# Altium schematic sheet uVNA.SchDoc
size A4; SheetNumber: 1; SheetTotal: 13
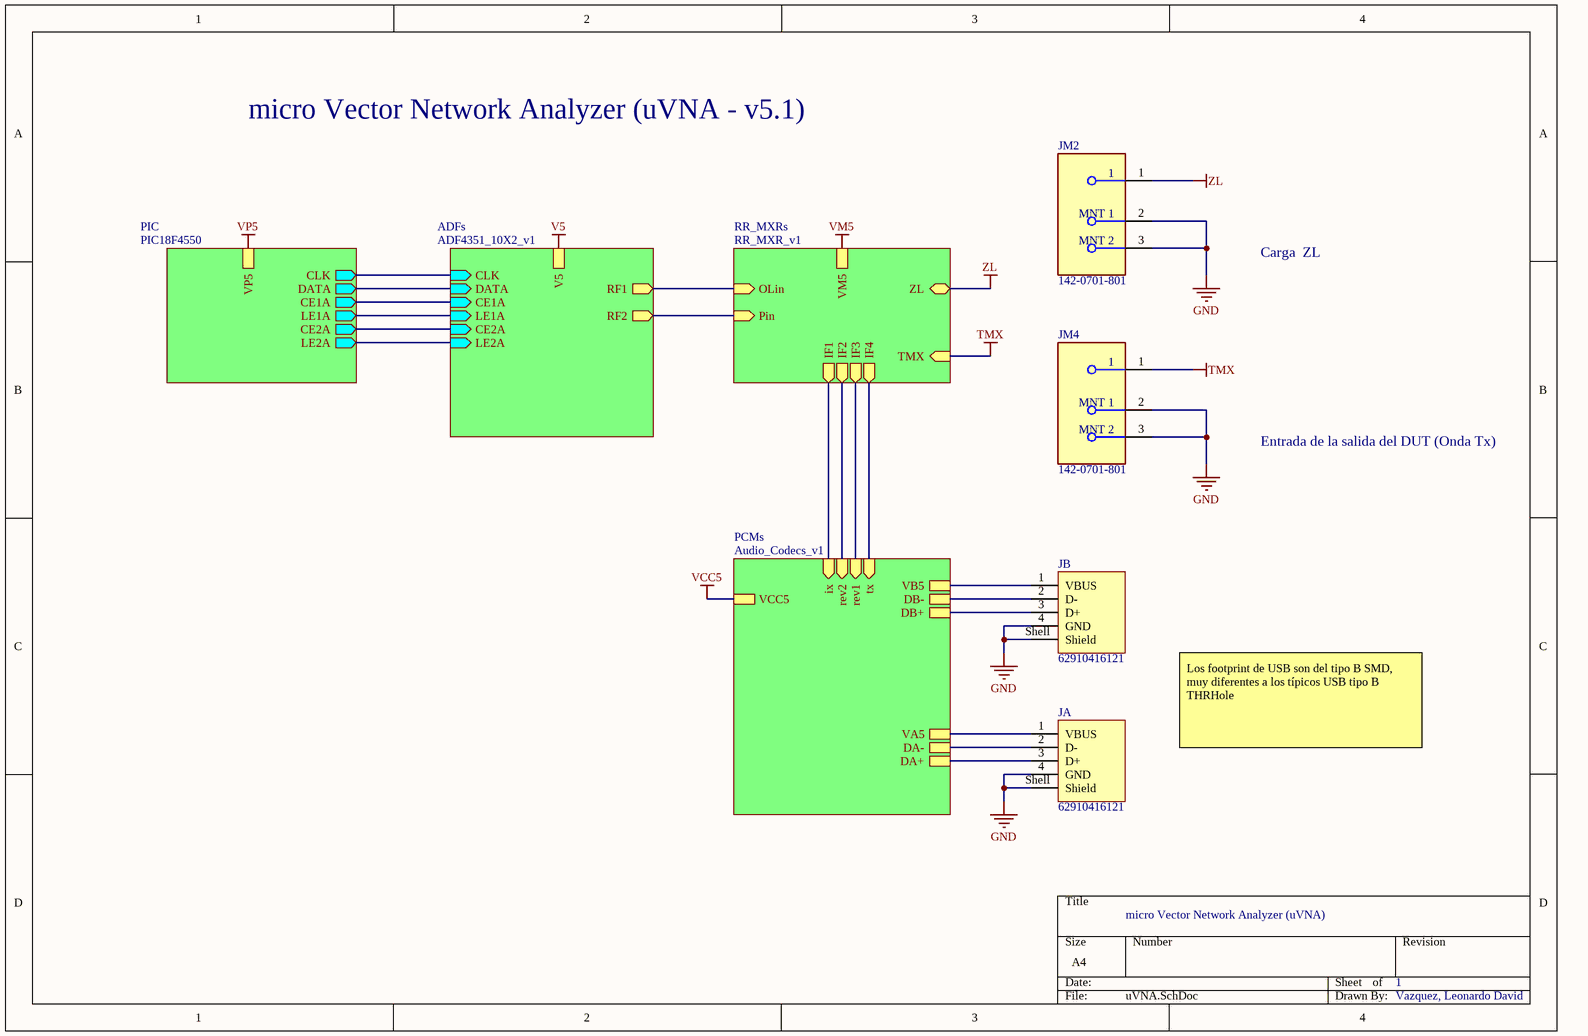
[diagram p0: uVNA.SchDoc]

## Parts
JA  62910416121  [62910416121]
JB  62910416121  [62910416121]
JM2  142-0701-801  [FP-142-0701-801-MFG]
JM4  142-0701-801  [FP-142-0701-801-MFG]

## Sub-sheets
ADFs = ADF4351_10X2_v1: V5, RF1 (out), RF2 (out), CLK (in), DATA (in), CE1A (in), LE1A (in), CE2A (in), LE2A (in)
PCMs = Audio_Codecs_v1: VCC5, rev1 (in), rev2 (in), ix (in), tx (in), DA+, DA-, VA5, VB5, DB-, DB+
PIC = PIC18F4550: VP5, CLK (out), DATA (out), CE1A (out), LE1A (out), LE2A (out), CE2A (out)
RR_MXRs = RR_MXR_v1: VM5, OLin (in), Pin (in), IF1 (out), IF4 (out), IF2 (out), IF3 (out), ZL (bidir), TMX (in)

## Nets
GND: JA.4(GND) JA.Shell(Shield) JB.4(GND) JB.Shell(Shield) JM2.2(MNT_1) JM2.3(MNT_2) JM4.2(MNT_1) JM4.3(MNT_2)
TMX: JM4.1 ; sheet RR_MXRs/TMX
V5: sheet ADFs/V5
VCC5: sheet PCMs/VCC5
VM5: sheet RR_MXRs/VM5
VP5: sheet PIC/VP5
ZL: JM2.1 ; sheet RR_MXRs/ZL
NetJA_1: JA.1(VBUS) ; sheet PCMs/VA5
NetJA_2: JA.2(D-) ; sheet PCMs/DA-
NetJA_3: JA.3(D+) ; sheet PCMs/DA+
NetJB_1: JB.1(VBUS) ; sheet PCMs/VB5
NetJB_2: JB.2(D-) ; sheet PCMs/DB-
NetJB_3: JB.3(D+) ; sheet PCMs/DB+
(unnamed): sheet ADFs/RF1, sheet RR_MXRs/OLin
(unnamed): sheet ADFs/RF2, sheet RR_MXRs/Pin
(unnamed): sheet ADFs/CLK, sheet PIC/CLK
(unnamed): sheet ADFs/DATA, sheet PIC/DATA
(unnamed): sheet ADFs/CE1A, sheet PIC/CE1A
(unnamed): sheet ADFs/LE1A, sheet PIC/LE1A
(unnamed): sheet ADFs/CE2A, sheet PIC/CE2A
(unnamed): sheet ADFs/LE2A, sheet PIC/LE2A
(unnamed): sheet RR_MXRs/IF1, sheet PCMs/ix
(unnamed): sheet RR_MXRs/IF4, sheet PCMs/tx
(unnamed): sheet RR_MXRs/IF2, sheet PCMs/rev2
(unnamed): sheet RR_MXRs/IF3, sheet PCMs/rev1

## Notes on the sheet
- micro Vector Network Analyzer (uVNA - v5.1)
- Carga  ZL
- Entrada de la salida del DUT (Onda Tx)
- Los footprint de USB son del tipo B SMD, muy diferentes a los típicos USB tipo B THRHole
- micro Vector Network Analyzer (uVNA)
- 1
- Vazquez, Leonardo David

## Library data of the parts
JA JB = CMP-1502-03244-2: NexarPartId: 19991172; Contact Resistance: 20mΩ; Connector Type: USB; Number of Contacts: 4; Gender: Receptacle; Current Rating: 1.5A; USB Standard: USB 2.0; Operating Supply Voltage: 30V; Insulation Resistance: 1GΩ; Orientation: Horizontal; RoHS: Compliant; Lead Free: Lead Free; Min Operating Temperature: -40°C; Length: 16mm; Number of Pins: 4; Features: Shielded; Contact Plating: Gold; Packaging: Tape and Reel; Max Operating Temperature: 105°C; Termination: SMD/SMT; Mount: Horizontal, Surface Mount; REACH SVHC: Unknown
JM2 JM4 = CMP-09588-000002-1: CONN SMA JACK STR 50OHM EDGE MNT; Frequency: 18GHz; Operating Frequency: 0 to 18 GHz; Body Material: Brass; Impedance: 50R; Voltage Rating: 335V; Gender: Female; Body Plating: Gold; Orientation: Straight; Length: 0.44inch; Max Operating Temperature: 165°C; Package Quantity: 5; Packaging: Bulk; Series: SMA; Contact Material: Copper; Min Operating Temperature: -65°C; Depth: 25.58mm; RoHS Compliant: Yes; Case/Package: SMA; Max Frequency: 18GHz; Radiation Hardening: No; Contact Plating: Gold; Mount: Edge; Connector Type: SMA; Fastening Type: Threaded; Termination: Solder